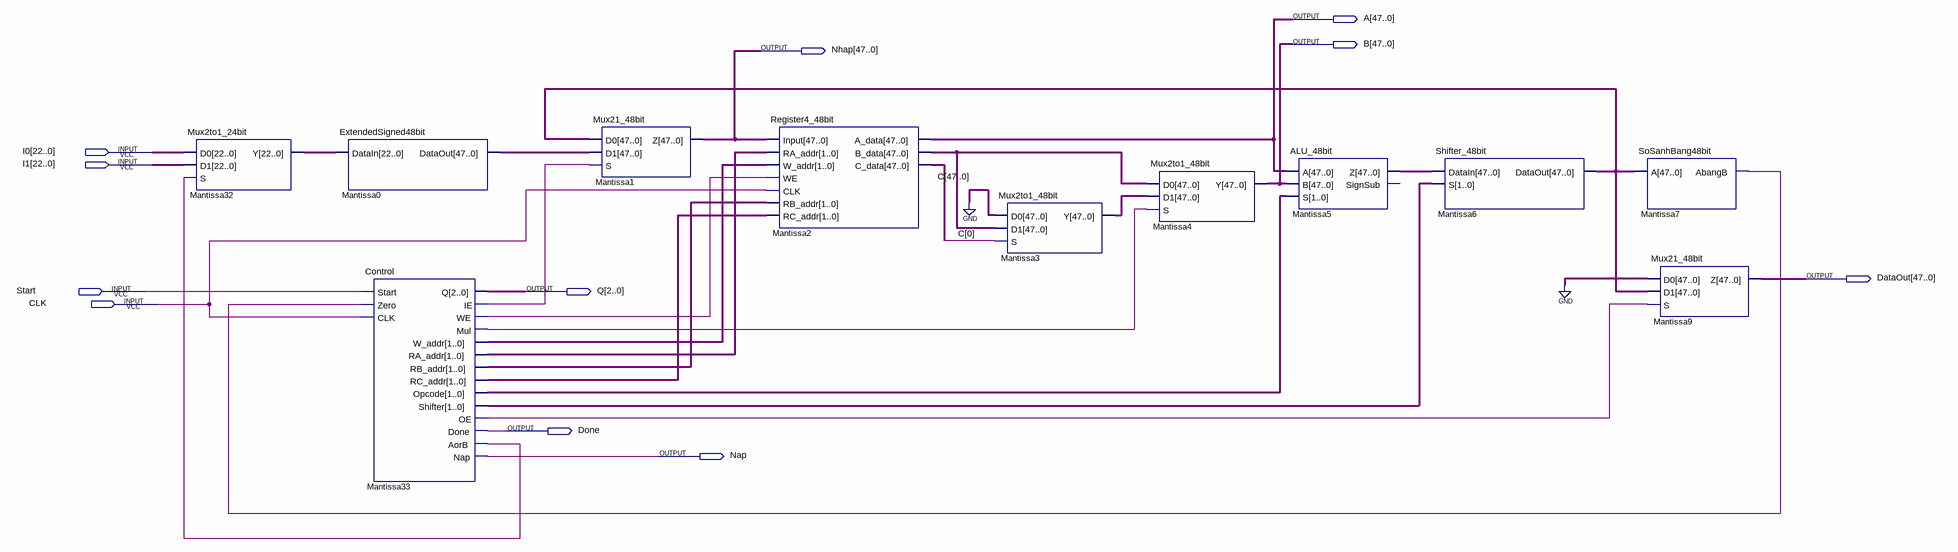
[diagram p0: schematic sheet]
// Quartus schematic Mantissa.bdf as structural Verilog: 11 symbols, 11 pins
module Mantissa (
  input  [22:0] I0,
  input  [22:0] I1,
  input  Start,
  input  CLK,
  output [47:0] A,
  output [47:0] B,
  output [47:0] Nhap,
  output [47:0] DataOut,
  output [2:0] Q,
  output Done,
  output Nap
);

  wire Mantissa7_abangb, Mantissa33_aorb, Mantissa33_ie, Mantissa33_mul, Mantissa33_oe, Mantissa33_we;
  wire [1:0] Mantissa33_opcode, Mantissa33_ra_addr, Mantissa33_rb_addr, Mantissa33_rc_addr,
       Mantissa33_shifter, Mantissa33_w_addr;
  wire [22:0] Mantissa32_y;
  wire [47:0] C, Mantissa0_dataout, Mantissa2_b_data, Mantissa3_y, Mantissa5_z, Mantissa6_dataout;

  Mux2to1_24bit Mantissa32 (.D0(I0), .D1(I1), .S(Mantissa33_aorb), .Y(Mantissa32_y));
  ExtendedSigned48bit Mantissa0 (.DataIn(Mantissa32_y), .DataOut(Mantissa0_dataout));
  Control Mantissa33 (
    .Start(Start), .Zero(Mantissa7_abangb), .CLK(CLK), .Q(Q), .IE(Mantissa33_ie), .WE(Mantissa33_we),
    .Mul(Mantissa33_mul), .W_addr(Mantissa33_w_addr), .RA_addr(Mantissa33_ra_addr),
    .RB_addr(Mantissa33_rb_addr), .RC_addr(Mantissa33_rc_addr), .Opcode(Mantissa33_opcode),
    .Shifter(Mantissa33_shifter), .OE(Mantissa33_oe), .Done(Done), .AorB(Mantissa33_aorb), .Nap(Nap));
  Mux21_48bit Mantissa1 (.D0(Mantissa6_dataout), .D1(Mantissa0_dataout), .S(Mantissa33_ie), .Z(Nhap));
  Register4_48bit Mantissa2 (
    .Input(Nhap), .RA_addr(Mantissa33_ra_addr), .W_addr(Mantissa33_w_addr), .WE(Mantissa33_we), .CLK(CLK),
    .RB_addr(Mantissa33_rb_addr), .RC_addr(Mantissa33_rc_addr), .A_data(A), .B_data(Mantissa2_b_data),
    .C_data(C));
  Mux2to1_48bit Mantissa3 (.D0({48{1'b0}}), .D1(Mantissa2_b_data), .S(C[0]), .Y(Mantissa3_y));
  Mux2to1_48bit Mantissa4 (.D0(Mantissa2_b_data), .D1(Mantissa3_y), .S(Mantissa33_mul), .Y(B));
  ALU_48bit Mantissa5 (.A(A), .B(B), .S(Mantissa33_opcode), .Z(Mantissa5_z));  // open: SignSub
  Shifter_48bit Mantissa6 (.DataIn(Mantissa5_z), .S(Mantissa33_shifter), .DataOut(Mantissa6_dataout));
  SoSanhBang48bit Mantissa7 (.A(Mantissa6_dataout), .AbangB(Mantissa7_abangb));
  Mux21_48bit Mantissa9 (.D0({48{1'b0}}), .D1(Mantissa6_dataout), .S(Mantissa33_oe), .Z(DataOut));
endmodule
